# Altium project e3.PrjPcb
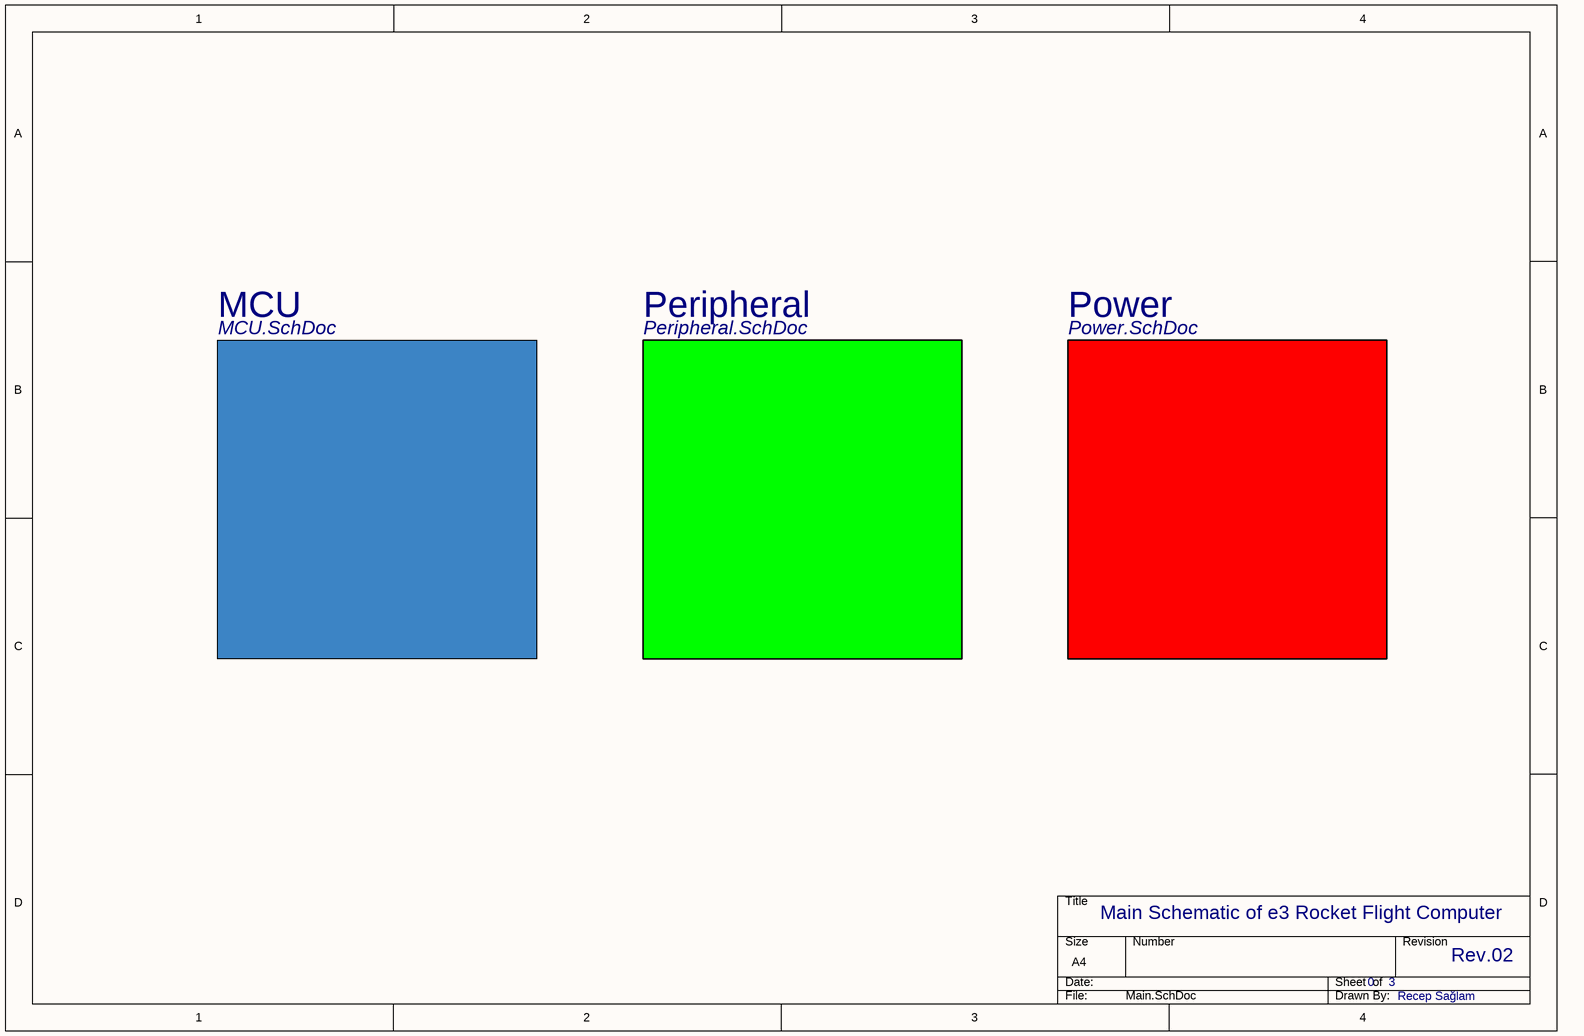
[diagram p0: Main.SchDoc]
4 sheets, 59 parts. Net scope: flat (ports and power ports of the same name join across sheets).
Board files: e3rev2.PcbDoc, e3rev1.PcbDoc
Sheets:
  Main.SchDoc
    MCU = MCU.SchDoc
    Power = Power.SchDoc
    Peripheral = Peripheral.SchDoc

## Sheet Main.SchDoc
size A4; SheetNumber: 1; SheetTotal: 4

### Sub-sheets
MCU = MCU.SchDoc: no entries
Peripheral = Peripheral.SchDoc: no entries
Power = Power.SchDoc: no entries

### Notes on the sheet
- Main Schematic of e3 Rocket Flight Computer
- 0
- 3
- Rev.02
- Recep Sağlam

## Sheet MCU.SchDoc
size 384 x 270 mm; SheetNumber: 2; SheetTotal: 4
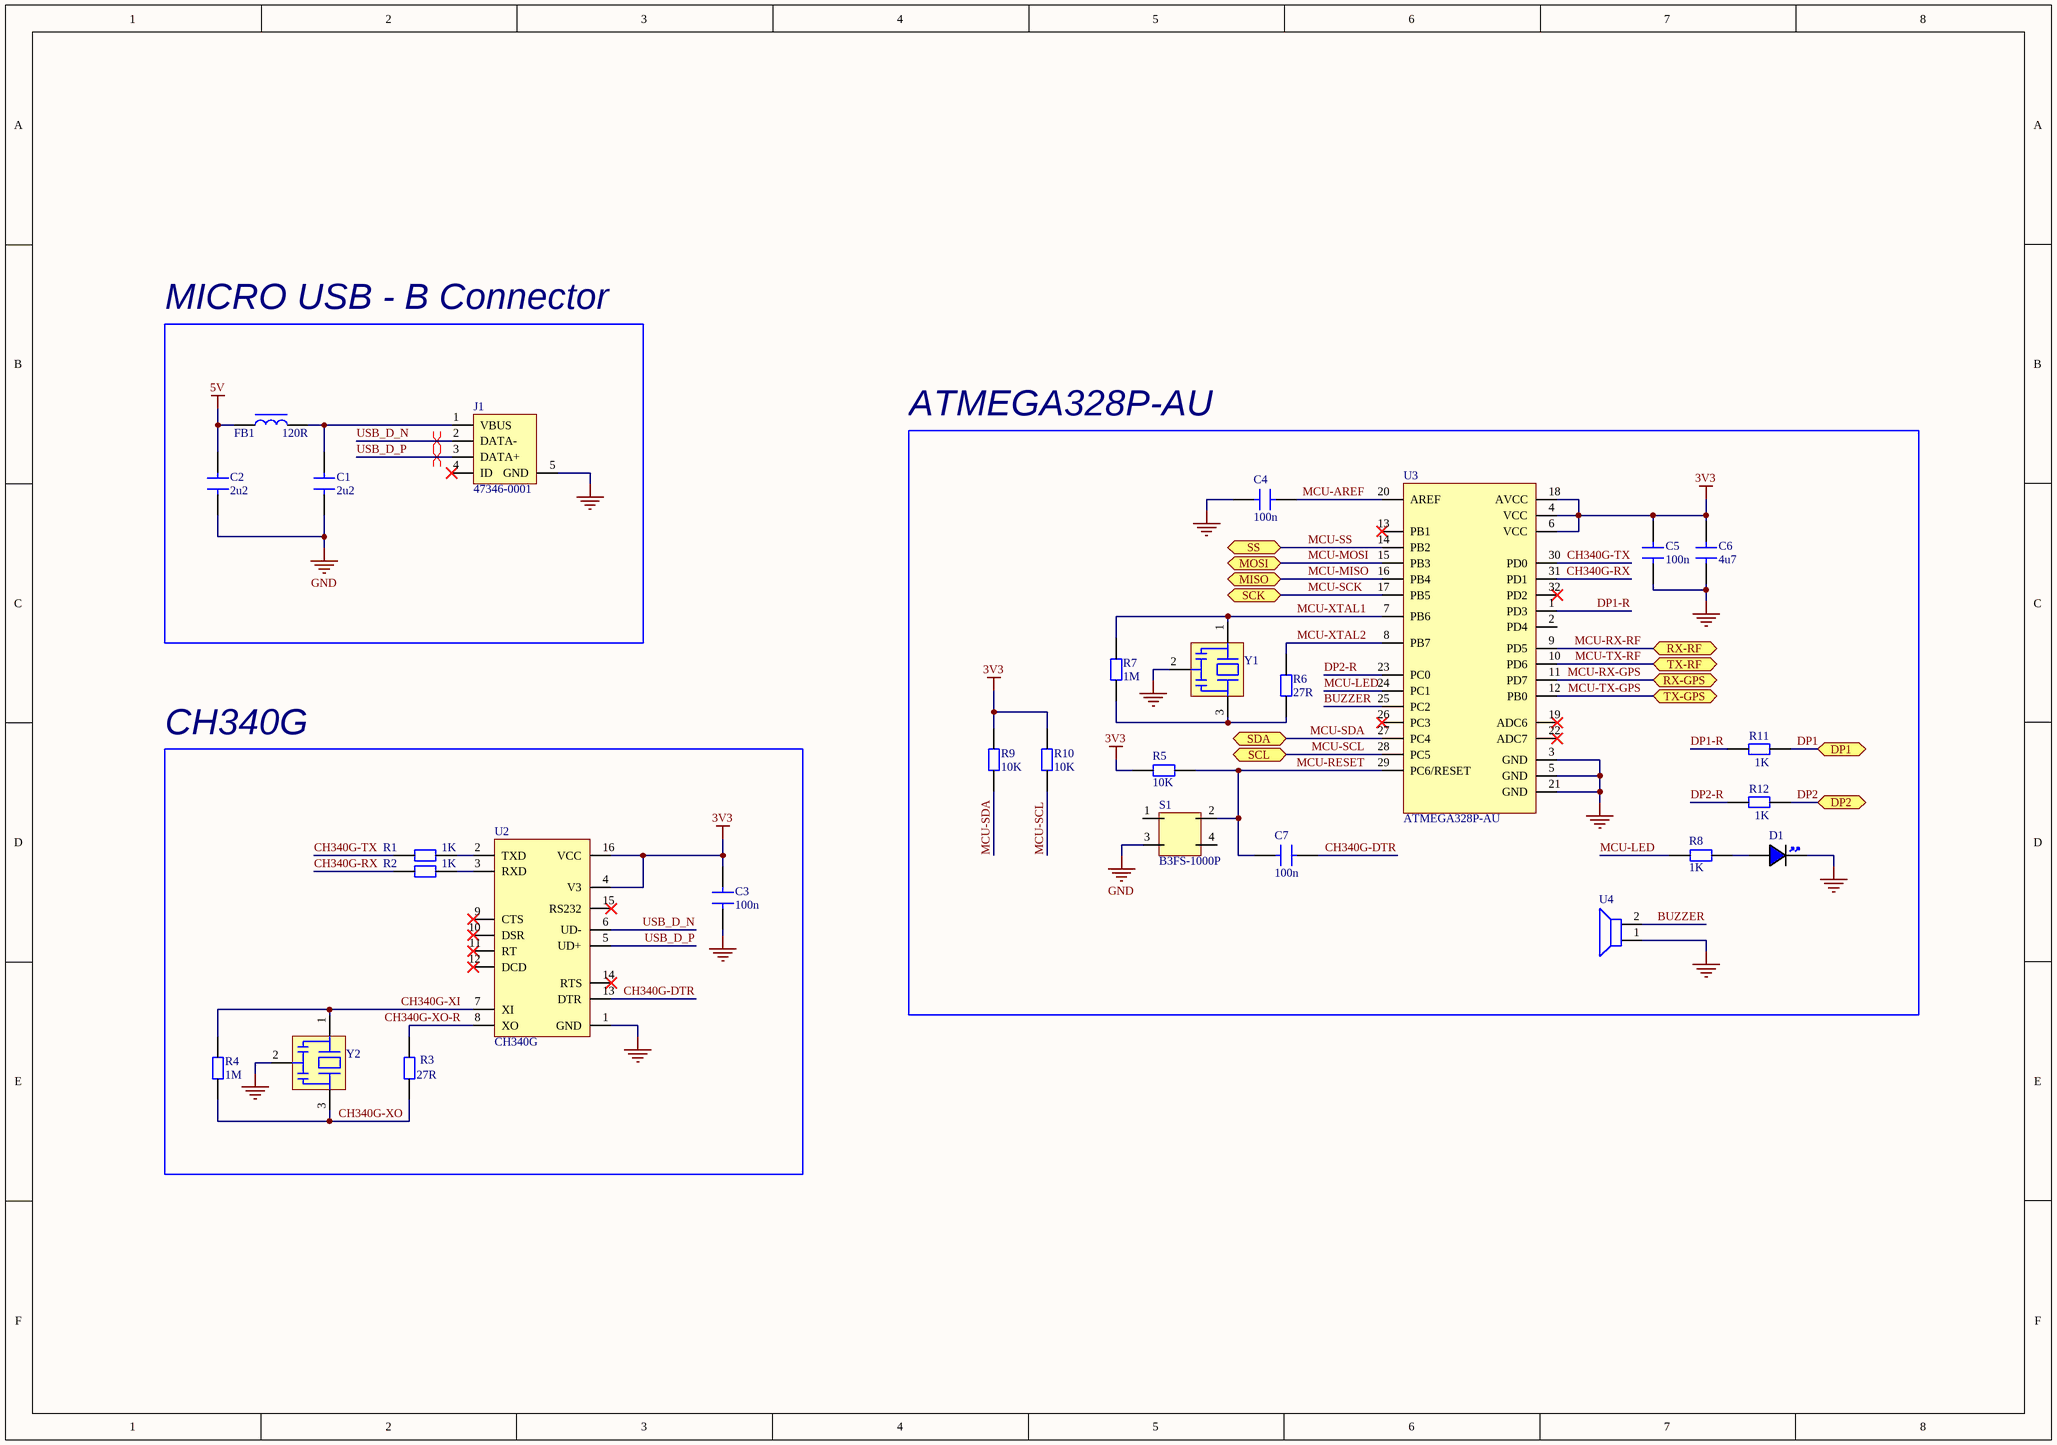
[diagram p1: MCU.SchDoc]

### Parts
C1  2u2  [CAP 0603]
C2  2u2  [CAP 0603]
C3  100n  [CAP 0603]
C4  100n  [CAP 0603]
C5  100n  [CAP 0603]
C6  4u7  [CAP 0603]
C7  100n  [CAP 0603]
D1  LED 0805 BLUE  [LED 0805 BLUE]  (value not drawn)
FB1  120R  [FB 0805]
J1  47346-0001  [MOLEX_47346-0001]
R1  1K  [RES 0603]
R2  1K  [RES 0603]
R3  27R  [RES 0603]
R4  1M  [RES 0603]
R5  10K  [RES 0603]
R6  27R  [RES 0603]
R7  1M  [RES 0603]
R8  1K  [RES 0603]
R9  10K  [RES 0603]
R10  10K  [RES 0603]
R11  1K  [RES 0603]
R12  1K  [RES 0603]
S1  B3FS-1000P  [B3FS-1000P]
U2  CH340G  [CH340G]
U3  ATMEGA328P-AU  [ATMEGA328P-AU]
U4  PS1240P02BT  [PS1240P02BT]  (value not drawn)
Y1  CSTNE16M0V53Z000R0  [CSTNE16M0V53Z000R0]  (value not drawn)
Y2  CSTNE12M0G550000R0  [CSTNE16M0V53Z000R0]  (value not drawn)

### Blocks framed on the sheet
MICRO USB - B Connector: C1 C2 FB1 J1
ATMEGA328P-AU: C4-C7 D1 R5-R12 S1 U3 U4 Y1
CH340G: C3 R1-R4 U2 Y2

### Ports
DP1 (bidir, see Power[1C]), DP2 (bidir, see Power[2C]), MISO (bidir, see Peripheral[1C], Peripheral[3D]), MOSI (bidir, see Peripheral[1C], Peripheral[3D]), RX-GPS (bidir, see Peripheral[4D]), RX-RF (bidir, see Peripheral[3D]), SCK (bidir, see Peripheral[1D], Peripheral[3D]), SCL (bidir, see Peripheral[2B], Peripheral[3A], Peripheral[3D]), SDA (bidir, see Peripheral[2A], Peripheral[3A], Peripheral[3D]), SS (bidir, see Peripheral[1C], Peripheral[3D]), TX-GPS (bidir, see Peripheral[4D]), TX-RF (bidir, see Peripheral[3D])

### Nets
3V3: C3.2 C5.2 C6.2 R5.1 R9.2 R10.2 U2.4(V3) U2.16(VCC) U3.4(VCC) U3.6(VCC) U3.18(AVCC)
5V: C2.1 FB1.1
GND: C1.2 C2.2 C3.1 C4.2 C5.1 C6.1 D1.K J1.5(GND) S1.3 U2.1(GND) U3.3(GND) U3.5(GND) U3.21(GND) U4.1 Y1.2 Y2.2
BUZZER: U3.25(PC2) U4.2
CH340G-DTR: C7.1 U2.13(DTR)
CH340G-RX: R2.2 U3.31(PD1)
CH340G-TX: R1.2 U3.30(PD0)
CH340G-XI: R4.2 U2.7(XI) Y2.1
CH340G-XO: R3.1 R4.1 Y2.3
CH340G-XO-R: R3.2 U2.8(XO)
DP1: R11.2 ; port DP1
DP1-R: R11.1 U3.1(PD3)
DP2: R12.2 ; port DP2
DP2-R: R12.1 U3.23(PC0)
MCU-AREF: C4.1 U3.20(AREF)
MCU-LED: R8.1 U3.24(PC1)
MCU-MISO: U3.16(PB4) ; port MISO
MCU-MOSI: U3.15(PB3) ; port MOSI
MCU-RESET: C7.2 R5.2 S1.2 U3.29(PC6/RESET)
MCU-RX-GPS: U3.11(PD7) ; port RX-GPS
MCU-RX-RF: U3.9(PD5) ; port RX-RF
MCU-SCK: U3.17(PB5) ; port SCK
MCU-SCL: R10.1 U3.28(PC5) ; port SCL
MCU-SDA: R9.1 U3.27(PC4) ; port SDA
MCU-SS: U3.14(PB2) ; port SS
MCU-TX-GPS: U3.12(PB0) ; port TX-GPS
MCU-TX-RF: U3.10(PD6) ; port TX-RF
MCU-XTAL1: R7.2 U3.7(PB6) Y1.1
MCU-XTAL2: R6.2 U3.8(PB7)
USB_D_N: J1.2(DATA-) U2.6(UD-)
USB_D_P: J1.3(DATA+) U2.5(UD+)
NetC1_1: C1.1 FB1.2 J1.1(VBUS)
NetD1_A: D1.A R8.2
NetR1_1: R1.1 U2.2(TXD)
NetR2_1: R2.1 U2.3(RXD)
NetR6_1: R6.1 R7.1 Y1.3

Not connected (* = marked no-connect by the designer): J1 4(ID)*; S1 1 4; U2 9(CTS)* 10(DSR)* 11(RT)* 12(DCD)* 14(RTS)* 15(RS232)*; U3 2(PD4) 13(PB1)* 19(ADC6)* 22(ADC7)* 26(PC3)* 32(PD2)*

### Layout directives
differential pair; differential pair class DIFF_USB: USB_D_N, USB_D_P

### Notes on the sheet
- DWG NO:
- REV:
- THIS DOCUMENT AND THE DATA DISCLOSED HEREIN OR
- HEREWITH IS THE PROPERTY OF ALTIUM LIMITED AND MAY
- BE FREELY DISTRIBUTED IN WHOLE. NO RIGHTS ARE
- RESERVED OR EXPRESS OR IMPLIED WARANTEE GIVEN.
- REVISION
- DESCRIPTION
- DATE
- APPROVED
- ENG:
- APPROVALS
- PROJECT
- DSN:
- CHK:
- REFERENCE DOCUMENTS
- PROJECT REVISION:
- TITLE
- DOCUMENT REVISION:
- DESIGN ITEM:
- BOM:
- FAB DWG:
- PCB DWG:
- ASSY DWG:
- SCALE:
- A2
- SIZE
- CAGE CODE
- FILE NAME
- DWG NO.
- SHEET
- OF
- REV

### Library data of the parts
C1-C7 = CAP 0603 50V: Capacitor SMD 0603 50V
D1 = LED 0805 BLUE: LED 0805 GREEN SMD
FB1 = FB 0805: Ferrite Bead SMD 0805
J1 = 47346-0001: Micro-USB B Receptacle with Flange, Bottom Mount, Surface Mount, Lead-Free; Manufacturer: Molex; Max Voltage Rating (AC): 30V; Number of Ports: 1; Contact Resistance: 40mR; Current Rating: 1.8A; Gender: Female; Connector Type: USB,Receptacle; Number of Contacts: 5; Contact Current Rating: 1A; USB Standard: USB 2.0; Pitch: 0.65mm; Glow Wire Compliant: Non-compliant; Supplier 1: Sager Electronics; Manufacturer Part Number: 47346-0001; RoHS: Yes; Category: Headers and Wire Housings; Stock 1: 14156; Pricing 1: 14000=0,5225 (USD); Mount: Surface Mount; Contact Plating: Gold; Contact Material: Copper Alloy,Copper; Housing Material: Polymer; Color: Black; Min Operating Temperature: -20°C; Max Operating Temperature: 85°C; Packaging: Tape and Reel; Termination: SMD/SMT; Orientation: Right Angle; Voltage Rating (AC): 30V; Voltage Rating: 30V; Number of Circuits: 5; Number of Positions: 5; Number of Rows: 1; Series: 47346; RoHS Compliant: Yes; Halogen Free: Low Halogen; Lead Free: Lead Free; Flammability Rating: UL94 V-0; Reach SVHC Compliant: Unknown; ComponentLink1URL: https://datasheet.ciiva.com/30075/304740473460001-io-nectors-30075527.pdf?src-supplier=Onlinecomponents.com; ComponentLink1Description: https://datasheet.ciiva.com/30075/304740473460001-io-nectors-30075527.pdf?src-supplier=Onlinecomponents.com; ComponentLink2URL: https://datasheet.ciiva.com/22654/1630785-22654942.pdf?src-supplier=Element14; ComponentLink2Description: https://datasheet.ciiva.com/22654/1630785-22654942.pdf?src-supplier=Element14; ComponentLink3URL: https://datasheet.ciiva.com/16148/1700180473460001-io-nectors-16148917.pdf?src-supplier=Onlinecomponents.com; ComponentLink3Description: https://datasheet.ciiva.com/16148/1700180473460001-io-nectors-16148917.pdf?src-supplier=Onlinecomponents.com; ComponentLink4URL: https://datasheet.ciiva.com/16986/70266948-16986683.pdf?src-supplier=Allied+Electronics; ComponentLink4Description: https://datasheet.ciiva.com/16986/70266948-16986683.pdf?src-supplier=Allied+Electronics; ComponentLink5URL: https://datasheet.ciiva.com/28504/0473460001-io-connectors-28504587.pdf?src-supplier=Element14; ComponentLink5Description: https://datasheet.ciiva.com/28504/0473460001-io-connectors-28504587.pdf?src-supplier=Element14; ComponentLink6URL: https://datasheet.ciiva.com/46390/1681853-46390956.pdf?src-supplier=Element14; ComponentLink6Description: https://datasheet.ciiva.com/46390/1681853-46390956.pdf?src-supplier=Element14
R1-R12 = RES 0603: Resistor SMD 0603
S1 = B3FS-1000P: Switch Tactile N.O. SPST Flat Round Button Gull Wing 0.05A 24VDC 0.98N SMD T/R; Manufacturer: Omron; Mechanical Life: 1000000Cycles; Actuator Color: Black; Current Rating: 50mA; Voltage Rating (DC): 24V; Contact Resistance: 100mR; Illumination Type: Non-Illuminated,Illuminated; Number of Poles: 1; Switch Travel: 0.25mm; Switch Function: Off-Mom; Actuator Type: Standard; Actuator Length: 0.5mm; Ratings: IP00; Supplier 1: Sager Electronics; Manufacturer Part Number: B3FS-1000P; RoHS: Yes; Category: Tactile Switches; Stock 1: 12000; Pricing 1: 3000=0,316, 12000=0,305 (USD); Mount: Surface Mount; Case/Package: SMD/SMT; Contact Plating: Silver; Weight: 0.2g; Contact Material: Silver; Material: Plastic; Min Operating Temperature: -20°C; Max Operating Temperature: 70°C; Package Quantity: 3000; Operating Force: 0.98N; Packaging: Tape and Reel; Contact Current Rating: 50mA; Throw Configuration: SPST; Max Current Rating: 50mA; Max Voltage Rating (DC): 24V; Termination: Gull Wing; Electrical Life: 1000000Cycles; Orientation: Straight; Series: B3FS; Length: 6.3mm; Depth: 8mm; Lead Free: Lead Free; RoHS Compliant: Yes; Reach SVHC Compliant: Unknown; ComponentLink1URL: https://datasheet.ciiva.com/1532/en-b3fs-1532627.pdf?src-supplier=Element14; ComponentLink1Description: https://datasheet.ciiva.com/1532/en-b3fs-1532627.pdf?src-supplier=Element14; ComponentLink2URL: https://datasheet.ciiva.com/16154/en-b3fs-16154936.pdf?src-supplier=Onlinecomponents.com; ComponentLink2Description: https://datasheet.ciiva.com/16154/en-b3fs-16154936.pdf?src-supplier=Onlinecomponents.com; ComponentLink3URL: https://datasheet.ciiva.com/26827/getdatasheetpartid-131603-26827237.pdf?src-supplier=Verical; ComponentLink3Description: https://datasheet.ciiva.com/26827/getdatasheetpartid-131603-26827237.pdf?src-supplier=Verical; ComponentLink4URL: https://datasheet.ciiva.com/30214/b3fs-0714-30214221.pdf?src-supplier=Onlinecomponents.com; ComponentLink4Description: https://datasheet.ciiva.com/30214/b3fs-0714-30214221.pdf?src-supplier=Onlinecomponents.com; ComponentLink5URL: https://datasheet.ciiva.com/2899/en-b3fs-2899745.pdf?src-supplier=Digi-Key; ComponentLink5Description: https://datasheet.ciiva.com/2899/en-b3fs-2899745.pdf?src-supplier=Digi-Key; ComponentLink6URL: https://datasheet.ciiva.com/2899/en-b3fs-2899746.pdf?src-supplier=Digi-Key; ComponentLink6Description: https://datasheet.ciiva.com/2899/en-b3fs-2899746.pdf?src-supplier=Digi-Key; ComponentLink7URL: https://datasheet.ciiva.com/2899/en-b3fs-2899744.pdf?src-supplier=Digi-Key; ComponentLink7Description: https://datasheet.ciiva.com/2899/en-b3fs-2899744.pdf?src-supplier=Digi-Key
U2 = CH340G: USB Interface Integrated Circuit
U3 = ATMEGA328P-AU: 8-bit AVR MCU, 32 KB, 2048 Bytes, 20 MHz, 1.8 to 5.5V, TQFP-32, RoHS; Manufacturer: Microchip; Interface: I2C,SPI,USART; Number of I/Os: 23; Oscillator Type: Internal; Memory Type: FLASH; Memory Size: 32KB; Peripherals: Brown-out Detect/Reset,POR,PWM,WDT; Frequency: 20MHz; RAM Size: 2KB; Min Supply Voltage: 1.8V; Number of Timers/Counters: 3; Number of ADC Channels: 8; Number of PWM Channels: 6; Data Bus Width: 8b; Number of SPI Channels: 1; Watchdog Timer: Yes; Supplier 1: Farnell; Manufacturer Part Number: ATMEGA328P-AU; RoHS: Yes; Stock 1: 196910; Pricing 1: 1=3,05, 25=2,48, 100=2,42, 250=2,37 (EUR); Mount: Surface Mount; Case/Package: A; Number of Pins: 32; Weight: 0.002469oz; Min Operating Temperature: -40°C; Max Operating Temperature: 85°C; Packaging: Tray; Core Architecture: AVR; Series: ATmega328P; Package Quantity: 250; Max Supply Voltage: 5.5V; Number of Programmable I/O: 23; Max Frequency: 20MHz; Number of I2C Channels: 1; Length: 7mm; Width: 7mm; Height: 1mm; Radiation Hardening: No; RoHS Compliant: Yes; Reach SVHC Compliant: Yes; Lead Free: Lead Free; ComponentLink1URL: https://datasheet.ciiva.com/1166/doc8161-1166860.pdf?src-supplier=Newark; ComponentLink1Description: https://datasheet.ciiva.com/1166/doc8161-1166860.pdf?src-supplier=Newark; ComponentLink2URL: https://datasheet.ciiva.com/29119/155196-da-01-en-microcontr-atmega328p-au-8bit-tqfp-32-29119594.pdf?src-supplier=Conrad; ComponentLink2Description: https://datasheet.ciiva.com/29119/155196-da-01-en-microcontr-atmega328p-au-8bit-tqfp-32-29119594.pdf?src-supplier=Conrad; ComponentLink3URL: https://datasheet.ciiva.com/1157/1693866-1157693.pdf?src-supplier=Element14; ComponentLink3Description: https://datasheet.ciiva.com/1157/1693866-1157693.pdf?src-supplier=Element14; ComponentLink4URL: https://datasheet.ciiva.com/15213/getdatasheetpartid-365828-15213131.pdf?src-supplier=Verical; ComponentLink4Description: https://datasheet.ciiva.com/15213/getdatasheetpartid-365828-15213131.pdf?src-supplier=Verical
U4 = PS1240P02BT: Audio Buzzer Piezo 30Vo-p 3Vo-p 70dBA Through Hole Pin Ammo; Manufacturer: TDK; Supplier 1: CoreStaff; Manufacturer Part Number: PS1240P02BT; RoHS: Yes; Category: Audio Products; Stock 1: 34; Pricing 1: 1=156, 10=90, 50=60, 100=45, 500=39, 1000=34,5, 2000=30, 4000=29,1 (JPY); ComponentLink1URL: https://datasheet.ciiva.com/0/ef532-ps-112.pdf?src-supplier=Digi-Key; ComponentLink1Description: https://datasheet.ciiva.com/0/ef532-ps-112.pdf?src-supplier=Digi-Key; ComponentLink2URL: https://datasheet.ciiva.com/0/ef532-ps-111.pdf?src-supplier=Digi-Key; ComponentLink2Description: https://datasheet.ciiva.com/0/ef532-ps-111.pdf?src-supplier=Digi-Key; ComponentLink3URL: https://datasheet.ciiva.com/3306/ef532-ps-3306958.pdf?src-supplier=Avnet; ComponentLink3Description: https://datasheet.ciiva.com/3306/ef532-ps-3306958.pdf?src-supplier=Avnet; ComponentLink4URL: https://datasheet.ciiva.com/16225/ef532-ps-16225062.pdf?src-supplier=Onlinecomponents.com; ComponentLink4Description: https://datasheet.ciiva.com/16225/ef532-ps-16225062.pdf?src-supplier=Onlinecomponents.com
Y1 = CSTNE16M0V53Z000R0: Ceramic Resonator 16MHz ±0.5% (Tol) ±0.3% (Stability) 15pF 40Ohm 3-Pin CSMD T/R; Manufacturer: Murata; Impedance: 40R; Supplier 1: Arrow Electronics; Manufacturer Part Number: CSTNE16M0V53Z000R0; RoHS: Yes; Category: Resonators; Stock 1: 87000; Pricing 1: 3000=0,1298, 6000=0,1244, 15000=0,1189 (USD); Mount: Surface Mount; Case/Package: SMD/SMT; Min Operating Temperature: -40°C; Max Operating Temperature: 125°C; Packaging: Cut Tape; Frequency: 16MHz; Frequency Stability: 0.3%; Frequency Tolerance: 0.5%; Capacitance: 15pF; Series: CERALOCK® CSTNE; RoHS Compliant: Yes; ComponentLink1URL: https://www.murata.com/en/products/productdata/8801162199070/SPEC-CSTNE16M0V53Z000R0.pdf?src-supplier=Digi-Key; ComponentLink1Description: https://www.murata.com/en/products/productdata/8801162199070/SPEC-CSTNE16M0V53Z000R0.pdf?src-supplier=Digi-Key
Y2 = CSTNE12M0G550000R0: Ceramic Resonator 12MHz ±0.5% (Tol ) ±0.2% (Stability) 33PF 30Ohm 3-Pin CSMD; Manufacturer: Murata; Supplier 1: CoreStaff; Manufacturer Part Number: CSTNE12M0G550000R0; RoHS: Yes; Category: Resonators; Stock 1: 10; Pricing 1: 1=77,6, 10=58,2, 50=36,86, 100=27,16, 500=17,46, 1000=15,52, 2000=14,55, 4000=14,36 (JPY); ComponentLink1URL: https://www.murata.com/en/products/productdata/8801162067998/SPEC-CSTNE12M0G550000R0.pdf?src-supplier=Digi-Key; ComponentLink1Description: https://www.murata.com/en/products/productdata/8801162067998/SPEC-CSTNE12M0G550000R0.pdf?src-supplier=Digi-Key; ComponentLink2URL: https://datasheet.octopart.com/CSTNE12M0G550000R0-Murata-datasheet-137044759.pdf?src-supplier=Future+Electronics; ComponentLink2Description: https://datasheet.octopart.com/CSTNE12M0G550000R0-Murata-datasheet-137044759.pdf?src-supplier=Future+Electronics; ComponentLink3URL: https://datasheet.octopart.com/CSTNE12M0G550000R0-Murata-datasheet-165611788.pdf?src-supplier=TME; ComponentLink3Description: https://datasheet.octopart.com/CSTNE12M0G550000R0-Murata-datasheet-165611788.pdf?src-supplier=TME

## Sheet Power.SchDoc
size A4; SheetNumber: 4; SheetTotal: 4
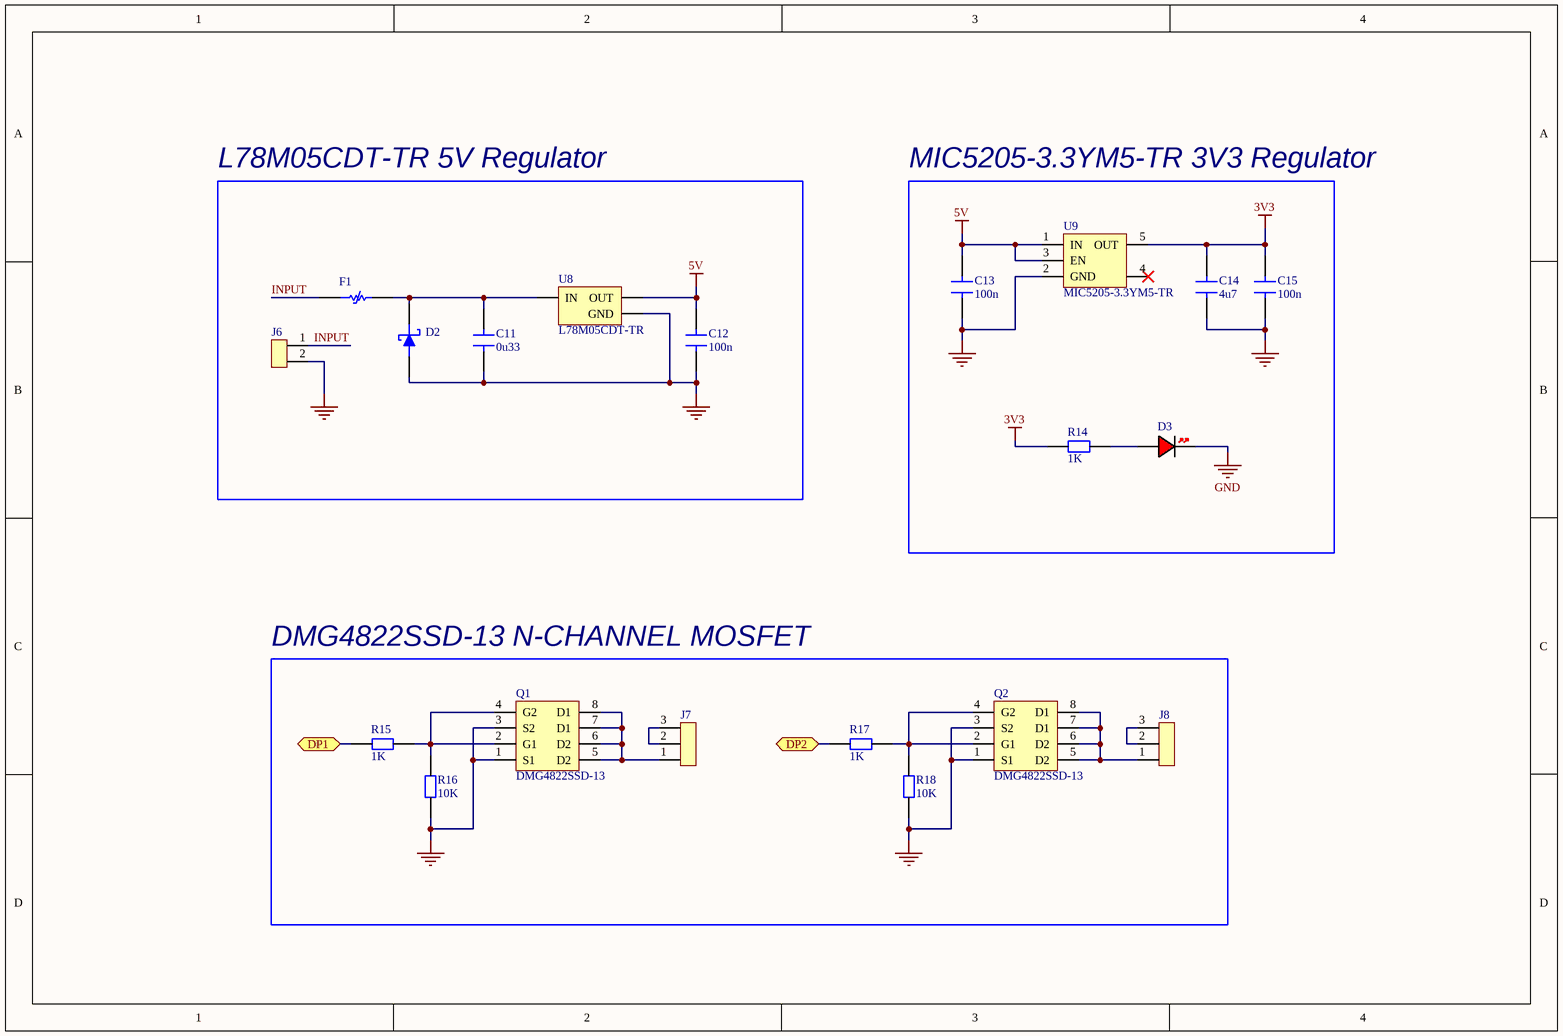
[diagram p2: Power.SchDoc]

### Parts
C11  0u33  [CAP 0805]
C12  100n  [CAP 0805]
C13  100n  [CAP 0805]
C14  4u7  [CAP 0805]
C15  100n  [CAP 0805]
D2  SMBJ12CA-13-F  [SMBJ12CA-13-F]  (value not drawn)
D3  LED 0805 RED  [LED 0805 RED]  (value not drawn)
F1  0ZCG0075FF2C  [0ZCG0075FF2C]  (value not drawn)
J6  KF301 2P Terminal  [KF301 2P]  (value not drawn)
J7  KF301 3P Terminal  [KF301 3P]  (value not drawn)
J8  KF301 3P Terminal  [KF301 3P]  (value not drawn)
Q1  DMG4822SSD-13  [DMG4822SSD-13]
Q2  DMG4822SSD-13  [DMG4822SSD-13]
R14  1K  [RES 0603]
R15  1K  [RES 0603]
R16  10K  [RES 0603]
R17  1K  [RES 0603]
R18  10K  [RES 0603]
U8  L78M05CDT-TR  [L78M05CDT-TR]
U9  MIC5205-3.3YM5-TR  [MIC5205-3.3YM5-TR]

### Blocks framed on the sheet
L78M05CDT-TR 5V Regulator: C11 C12 D2 F1 J6 U8
MIC5205-3.3YM5-TR 3V3 Regulator: C13-C15 D3 R14 U9
DMG4822SSD-13 N-CHANNEL MOSFET: J7 J8 Q1 Q2 R15-R18

### Ports
DP1 (bidir, see MCU[7C]), DP2 (bidir, see MCU[7C])

### Nets
3V3: C14.2 C15.2 R14.1 U9.5(OUT)
5V: C12.2 C13.2 U8.3(OUT) U9.1(IN) U9.3(EN)
GND: C11.1 C12.1 C13.1 C14.1 C15.1 D2.1 D3.K J6.2 Q1.1(S1) Q1.3(S2) Q2.1(S1) Q2.3(S2) R16.1 R18.1 U8.2(GND) U9.2(GND)
DP1: R15.1 ; port DP1
DP2: R17.1 ; port DP2
INPUT: F1.1 J6.1
NetC11_2: C11.2 D2.2 F1.2 U8.1(IN)
NetD3_A: D3.A R14.2
NetJ7_1: J7.1 Q1.5(D2) Q1.6(D2) Q1.7(D1) Q1.8(D1)
NetJ7_2: J7.2 J7.3
NetJ8_1: J8.1 Q2.5(D2) Q2.6(D2) Q2.7(D1) Q2.8(D1)
NetJ8_2: J8.2 J8.3
NetQ1_2: Q1.2(G1) Q1.4(G2) R15.2 R16.2
NetQ2_2: Q2.2(G1) Q2.4(G2) R17.2 R18.2

Not connected (* = marked no-connect by the designer): U9 4*

### Library data of the parts
C11-C15 = CAP 0805 50V: Capacitor SMD 0805 50V
D2 = SMBJ12CA-13-F: TVS DIODE 12VWM 19.9VC SMB; Manufacturer: Diodes; Package Body Material: Plastic; Diode Element Material: SILICON; Voltage Rating (DC): 12V; Direction: Bidirectional; Reverse Breakdown Voltage: 13.3V; Number of Elements: 1; Max Power Dissipation: 600W; Max Surge Current: 30.2A; Breakdown Voltage: 15.3V; Clamping Voltage: 19.9V; Max Reverse Leakage Current: 5uA; Test Current: 1mA; Capacitance: 340pF; Diode Type: ZENER; Time @ Peak Reflow Temperature-Max (s): 5s; Power Line Protection: No; Supplier 1: Future Electronics; Manufacturer Part Number: SMBJ12CA-13-F; RoHS: Yes; Category: TVS Diodes; Stock 1: 27000; Pricing 1: 3000=0,104, 9000=0,0995, 12000=0,0985, 30000=0,0953, 45000=0,0922 (USD); Mount: Surface Mount; Case/Package: SMB; Number of Pins: 2; Terminal Finish: Tin; Package Shape: Rectangular; Min Operating Temperature: -55°C; Max Operating Temperature: 150°C; Package Quantity: 3000; Packaging: Tape and Reel; Series: SMBJ; Reverse Standoff Voltage: 12V; Polarity: Bidirectional; Peak Pulse Power: 600W; Termination: SMD/SMT; Min Breakdown Voltage: 13.3V; Peak Pulse Current: 30.2A; Max Breakdown Voltage: 15.3V; Power Dissipation: 600W; Leakage Current: 5uA; Working Voltage: 12V; Max Output Current: 30.2A; Moisture Sensitivity Level: 1; JESD-30 Code: R-PDSO-C2; Surface Mount: Yes; Terminal Position: DUAL; Technology: AVALANCHE; Peak Reflow Temperature (Cel): 245°C; Terminal Form: C BEND; Clamping Voltage-Max: 19.9V; Number of Bidirectional Channels: 1; Length: 4.57mm; Width: 3.9mm; Height: 2.62mm; Radiation Hardening: No; Lead Free: Contains Lead; RoHS Compliant: Yes; ComponentLink1URL: https://datasheet.ciiva.com/34302/1542303-34302437.pdf?src-supplier=Jameco; ComponentLink1Description: https://datasheet.ciiva.com/34302/1542303-34302437.pdf?src-supplier=Jameco
D3 = LED 0805 RED: LED 0805 RED SMD
F1 = 0ZCG0075FF2C: PTC Resettable Fuse 0.75A(hold) 1.5A(trip) 16VDC 100A 0.8W 0.2s 0.11Ohm SMD Solder Pad 1812 4.73 X 3.41 X 0.65mm T/R...; Manufacturer: Bel; Hold Current: 750mA; Time to Trip: 200ms; Supplier 1: Arrow Electronics; Manufacturer Part Number: 0ZCG0075FF2C; RoHS: Yes; Category: PTC Resettable Fuses; Stock 1: 4661; Pricing 1: 2000=0,0751, 4000=0,0699, 6000=0,065, 10000=0,0604 (USD); Mount: Surface Mount; Case/Package: 1812; Case Code (Metric): 4532; Case Code (Imperial): 1812; Contact Plating: Tin,Matte; Min Operating Temperature: -40°C; Max Operating Temperature: 85°C; Packaging: Cut Tape; Max Current Rating: 100A; Trip Current: 1.5A; Series: 0ZCG; Lead Free: Lead Free; RoHS Compliant: Yes; ComponentLink1URL: https://datasheet.ciiva.com/18550/0zcg-18550523.pdf?src-supplier=Digi-Key; ComponentLink1Description: https://datasheet.ciiva.com/18550/0zcg-18550523.pdf?src-supplier=Digi-Key; ComponentLink2URL: https://datasheet.ciiva.com/18550/0zcg-18550524.pdf?src-supplier=Digi-Key; ComponentLink2Description: https://datasheet.ciiva.com/18550/0zcg-18550524.pdf?src-supplier=Digi-Key; ComponentLink3URL: https://datasheet.ciiva.com/18550/0zcg-18550767.pdf?src-supplier=Digi-Key; ComponentLink3Description: https://datasheet.ciiva.com/18550/0zcg-18550767.pdf?src-supplier=Digi-Key
J6 = KF301 2P Terminal: 2 Pin Screw Terminal Block 5mm
J7 J8 = KF301 3P Terminal: 3 Pin Screw Terminal Block 5mm
Q1 Q2 = DMG4822SSD-13: Dual N-Channel 30 V 1.42 W 10.5 nC Enhancement Mode Mosfet - SOIC-8; Manufacturer: Diodes; Rds On Max: 20mR; Input Capacitance: 478.9pF; Rise Time: 7.9ns; Drain to Source Voltage (Vdss): 30V; Continuous Drain Current (ID): 10A; Max Power Dissipation: 1.42W; Fall Time: 3.1ns; Turn-Off Delay Time: 14.6ns; Turn-On Delay Time: 2.9ns; Gate to Source Voltage (Vgs): 25V; Number of Channels: 2; FET Type: 2 N-Channel; Supplier 1: Arrow Electronics; Manufacturer Part Number: DMG4822SSD-13; RoHS: Yes; Category: MOSFETs; Stock 1: 2374; Pricing 1: 1=0,5556, 10=0,4998, 25=0,4948, 100=0,3987, 250=0,3947, 500=0,3232, 1000=0,265 (USD); Mount: Surface Mount; Case/Package: SOIC; Number of Pins: 8; Weight: 0.00261oz; Min Operating Temperature: -55°C; Max Operating Temperature: 150°C; Package Quantity: 2500; Packaging: Tape and Reel; Drain to Source Resistance: 20mR; Polarity: N-CHANNEL; Series: -; Length: 4.95mm; Width: 3.95mm; Height: 1.5mm; Radiation Hardening: No; Lead Free: Lead Free; Reach SVHC Compliant: Yes; RoHS Compliant: Yes; ComponentLink1URL: https://datasheet.ciiva.com/4443/dmg4822ssd-10758-4443079.pdf?src-supplier=Mouser; ComponentLink1Description: https://datasheet.ciiva.com/4443/dmg4822ssd-10758-4443079.pdf?src-supplier=Mouser; ComponentLink2URL: https://datasheet.ciiva.com/6386/dmg4822ssd-6386688.pdf?src-supplier=Digi-Key; ComponentLink2Description: https://datasheet.ciiva.com/6386/dmg4822ssd-6386688.pdf?src-supplier=Digi-Key; ComponentLink3URL: https://datasheet.ciiva.com/11174/dmg4822ssd-11174891.pdf?src-supplier=Avnet; ComponentLink3Description: https://datasheet.ciiva.com/11174/dmg4822ssd-11174891.pdf?src-supplier=Avnet
R14-R18 = RES 0603: Resistor SMD 0603
U8 = L78M05CDT-TR: IC REG LDO 5V 0.5A DPAK; Manufacturer: STMicroelectronics; Number of Outputs: 1; Max Input Voltage: 35V; Max Output Current: 500mA; Polarity: Positive; Quiescent Current: 6mA; Output Type: Fixed; Min Input Voltage: 7V; Dropout Voltage: 2V; Tolerance: 5%; Power Supply Rejection Ratio (PSRR): 62dB; Supplier 1: Mouser; Manufacturer Part Number: L78M05CDT-TR; RoHS: Yes; Category: Voltage Regulators - Linear; Stock 1: 74380; Pricing 1: 1=0,72, 10=0,629, 50=0,629, 100=0,482, 1000=0,305, 10000=0,277 (USD); Mount: Surface Mount; Case/Package: TO-252; Number of Pins: 3; Min Operating Temperature: 0°C; Max Operating Temperature: 150°C; Output Voltage: 5V; Packaging: Tape and Reel; Package Quantity: 2500; Output Current: 500mA; Nominal Output Voltage: 5V; Number of Regulators: 1; Min Output Voltage: 5V; Max Output Voltage: 5V; Series: -; Output Configuration: Positive; Length: 6.6mm; Width: 6.2mm; Height: 2.4mm; Radiation Hardening: No; RoHS Compliant: Yes; Reach SVHC Compliant: No; Lead Free: Lead Free; ComponentLink1URL: https://datasheet.ciiva.com/34303/2021024-34303902.pdf?src-supplier=Jameco; ComponentLink1Description: https://datasheet.ciiva.com/34303/2021024-34303902.pdf?src-supplier=Jameco; ComponentLink2URL: https://datasheet.ciiva.com/4882/cd00000447-93067-4882369.pdf?src-supplier=Mouser; ComponentLink2Description: https://datasheet.ciiva.com/4882/cd00000447-93067-4882369.pdf?src-supplier=Mouser; ComponentLink3URL: https://datasheet.ciiva.com/15111/getdatasheetpartid-111001-15111751.pdf?src-supplier=Verical; ComponentLink3Description: https://datasheet.ciiva.com/15111/getdatasheetpartid-111001-15111751.pdf?src-supplier=Verical; ComponentLink4URL: https://datasheet.ciiva.com/1512/1834365-1512349.pdf?src-supplier=Element14; ComponentLink4Description: https://datasheet.ciiva.com/1512/1834365-1512349.pdf?src-supplier=Element14; ComponentLink5URL: https://datasheet.ciiva.com/14111/tbl78mxxc-data-e-14111354.pdf?src-supplier=Distrelec; ComponentLink5Description: https://datasheet.ciiva.com/14111/tbl78mxxc-data-e-14111354.pdf?src-supplier=Distrelec; ComponentLink6URL: https://datasheet.ciiva.com/46425/1834365-46425535.pdf?src-supplier=Element14; ComponentLink6Description: https://datasheet.ciiva.com/46425/1834365-46425535.pdf?src-supplier=Element14; ComponentLink7URL: https://datasheet.ciiva.com/2041/cd00000447-2041991.pdf?src-supplier=Digi-Key; ComponentLink7Description: https://datasheet.ciiva.com/2041/cd00000447-2041991.pdf?src-supplier=Digi-Key; ComponentLink8URL: https://datasheet.ciiva.com/2041/cd00000447-2041990.pdf?src-supplier=Digi-Key; ComponentLink8Description: https://datasheet.ciiva.com/2041/cd00000447-2041990.pdf?src-supplier=Digi-Key; ComponentLink9URL: https://datasheet.ciiva.com/2041/cd00000447-2041992.pdf?src-supplier=Digi-Key; ComponentLink9Description: https://datasheet.ciiva.com/2041/cd00000447-2041992.pdf?src-supplier=Digi-Key; ComponentLink10URL: https://datasheet.ciiva.com/16443/cd00000447-16443381.pdf?src-supplier=Future+Electronics; ComponentLink10Description: https://datasheet.ciiva.com/16443/cd00000447-16443381.pdf?src-supplier=Future+Electronics; ComponentLink11URL: https://datasheet.ciiva.com/41439/001184659-da-01-en-ic-reg-ldo-5v-l78m05cdt-tr-to-252-3-stm-41439772.pdf?src-supplier=Conrad; ComponentLink11Description: https://datasheet.ciiva.com/41439/001184659-da-01-en-ic-reg-ldo-5v-l78m05cdt-tr-to-252-3-stm-41439772.pdf?src-supplier=Conrad
U9 = MIC5205-3.3YM5-TR: Linear Voltage Regulator IC Positive Fixed 1 Output 3.3V 150mA SOT-23-5; Manufacturer: Microchip; Dropout Voltage: 165mV; Number of Regulators: 1; Min Input Voltage: 2.5V; Max Input Voltage: 16V; Power Supply Rejection Ratio (PSRR): 75dB; Accuracy: 1%; Supplier 1: Arrow Electronics; Manufacturer Part Number: MIC5205-3.3YM5-TR; RoHS: Yes; Category: Voltage Regulators - Linear; Stock 1: 2538; Pricing 1: 1=0,5386, 10=0,5334, 25=0,4417, 50=0,4373, 100=0,395, 250=0,3909, 500=0,3869, 1000=0,3827, 3000=0,3677 (USD); Mount: Surface Mount; Case/Package: SOT-23; Number of Pins: 5; Min Operating Temperature: -40°C; Max Operating Temperature: 125°C; Packaging: Tape and Reel; Output Voltage: 3.3V; Output Current: 150mA; Nominal Output Voltage: 3.3V; Number of Outputs: 1; Output Type: Fixed; Polarity: Positive; Series: -; Max Output Current: 150mA; Output Voltage Accuracy: 1%; Max Output Voltage: 3.3V; Max Supply Voltage: 16V; Min Supply Voltage: 2.5V; Termination: SMD/SMT; Length: 2.9mm; Width: 1.6mm; Height: 1.1mm; Radiation Hardening: No; Reach SVHC Compliant: No; Lead Free: Lead Free; RoHS Compliant: Yes

## Sheet Peripheral.SchDoc
size A4; SheetNumber: 3; SheetTotal: 4
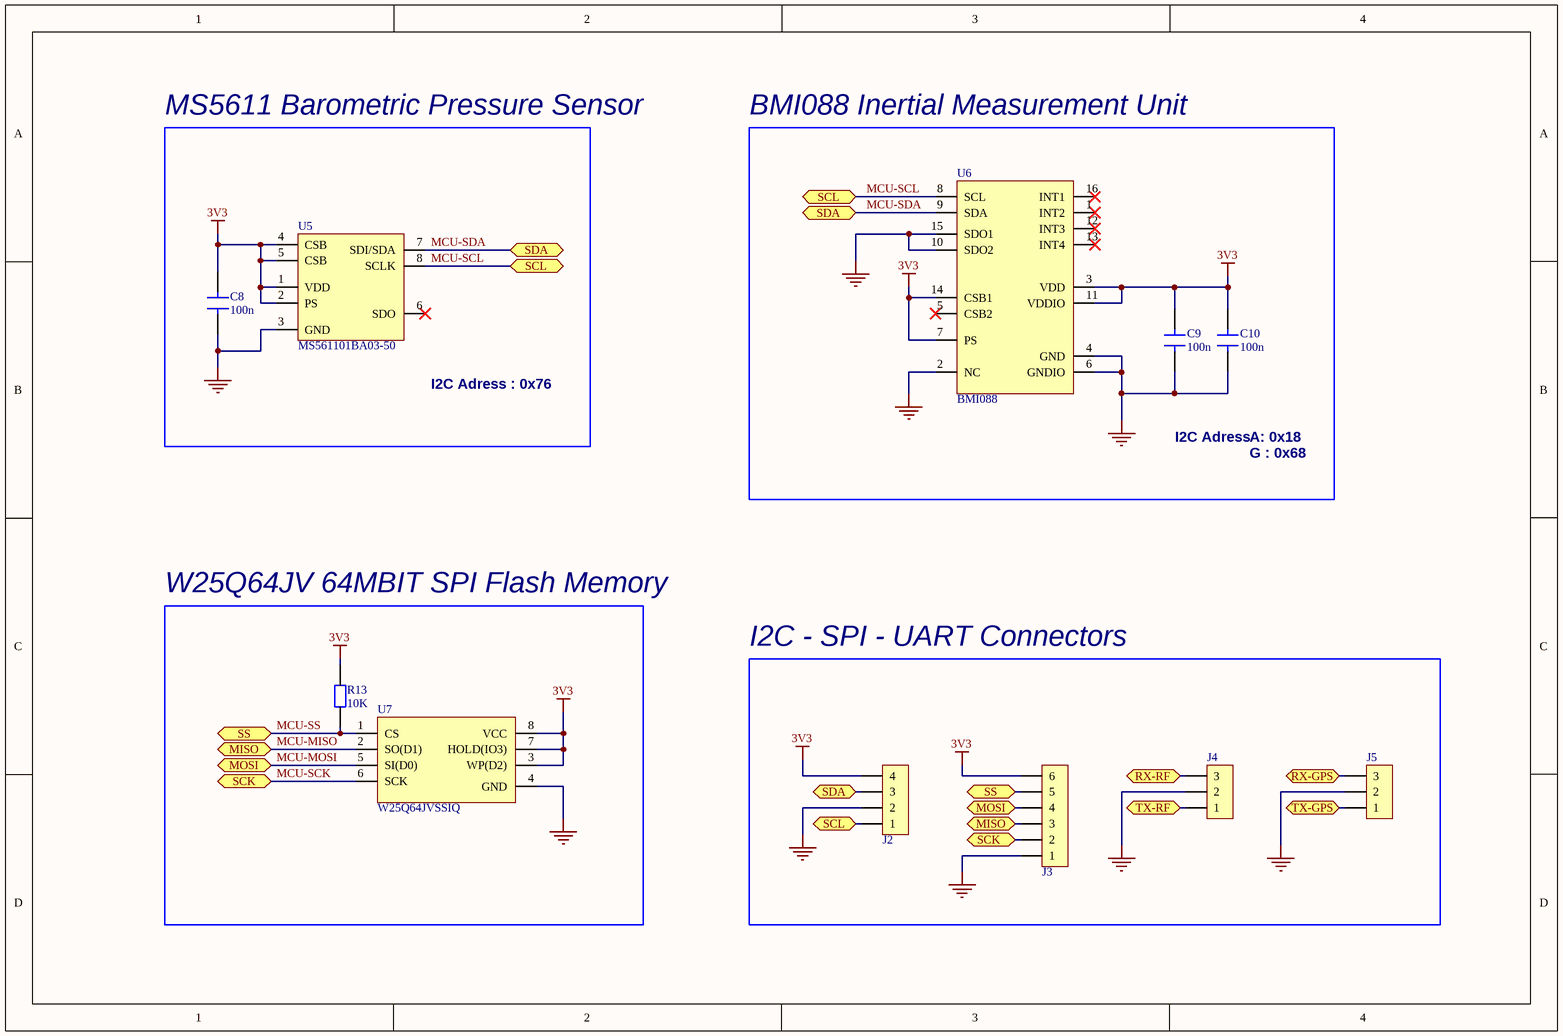
[diagram p3: Peripheral.SchDoc]

### Parts
C8  100n  [CAP 0603]
C9  100n  [CAP 0603]
C10  100n  [CAP 0603]
J2  1x4 HEADER MALE  [1X4 HEADER MALE]  (value not drawn)
J3  1x6 HEADER MALE  [1X6 HEADER MALE]  (value not drawn)
J4  JST B3B-XH-A  [JST_B3B-XH-A]  (value not drawn)
J5  JST B3B-XH-A  [JST_B3B-XH-A]  (value not drawn)
R13  10K  [RES 0603]
U5  MS561101BA03-50  [MS5611-01BA3]
U6  BMI088  [BMI088]
U7  W25Q64JVSSIQ  [W25Q64JVSSIQ]

### Blocks framed on the sheet
MS5611 Barometric Pressure Sensor: C8 U5
BMI088 Inertial Measurement Unit: C9 C10 U6
W25Q64JV 64MBIT SPI Flash Memory: R13 U7
I2C - SPI - UART Connectors: J2-J5

### Ports
MISO (bidir, see MCU[5C], Peripheral[1C]), MISO (bidir, see MCU[5C], Peripheral[3D]), MOSI (bidir, see MCU[5C], Peripheral[1C]), MOSI (bidir, see MCU[5C], Peripheral[3D]), RX-GPS (bidir, see MCU[7C]), RX-RF (bidir, see MCU[7C]), SCK (bidir, see MCU[5C], Peripheral[1D]), SCK (bidir, see MCU[5C], Peripheral[3D]), SCL (bidir, see MCU[5D], Peripheral[2B], Peripheral[3A]), SCL (bidir, see MCU[5D], Peripheral[2B], Peripheral[3D]), SCL (bidir, see MCU[5D], Peripheral[3A], Peripheral[3D]), SDA (bidir, see MCU[5D], Peripheral[2A], Peripheral[3A]), SDA (bidir, see MCU[5D], Peripheral[2A], Peripheral[3D]), SDA (bidir, see MCU[5D], Peripheral[3A], Peripheral[3D]), SS (bidir, see MCU[5C], Peripheral[1C]), SS (bidir, see MCU[5C], Peripheral[3D]), TX-GPS (bidir, see MCU[7C]), TX-RF (bidir, see MCU[7C])

### Nets
3V3: C8.2 C9.2 C10.2 J2.4 J3.6 R13.2 U5.1(VDD) U5.2(PS) U5.4(CSB) U5.5(CSB) U6.3(VDD) U6.7(PS) U6.11(VDDIO) U6.14(CSB1) U7.3(WP(D2)) U7.7(HOLD(IO3)) U7.8(VCC)
GND: C8.1 C9.1 C10.1 J2.2 J3.1 J4.2 J5.2 U5.3(GND) U6.2(NC) U6.4(GND) U6.6(GNDIO) U6.10(SDO2) U6.15(SDO1) U7.4(GND)
MCU-MISO: J3.3 U7.2(SO(D1)) ; port MISO
MCU-MOSI: J3.4 U7.5(SI(D0)) ; port MOSI
MCU-RX-GPS: J5.3 ; port RX-GPS
MCU-RX-RF: J4.3 ; port RX-RF
MCU-SCK: J3.2 U7.6(SCK) ; port SCK
MCU-SCL: J2.1 U5.8(SCLK) U6.8(SCL) ; port SCL
MCU-SDA: J2.3 U5.7(SDI/SDA) U6.9(SDA) ; port SDA
MCU-SS: J3.5 R13.1 U7.1(CS) ; port SS
MCU-TX-GPS: J5.1 ; port TX-GPS
MCU-TX-RF: J4.1 ; port TX-RF

Not connected (* = marked no-connect by the designer): U5 6(SDO)*; U6 1(INT2)* 5(CSB2)* 12(INT3)* 13(INT4)* 16(INT1)*

### Notes on the sheet
- I2C Adress : 0x76
- I2C Adress
- A: 0x18
- G : 0x68

### Library data of the parts
C8-C10 = CAP 0603 50V: Capacitor SMD 0603 50V
J4 J5 = JST B3B-XH-A: Connector Header, XH Series, 3 Position, 2.50mm, Through Hole, Press-Fit, Solder, Natural; Manufacturer Part Number: B3B-XH-A(LF)(SN); Supplier 1: CoreStaff; Manufacturer: JST; RoHS: Yes; Category: Headers and Wire Housings; Stock 1: 2101; Pricing 1: 1=39,94, 10=25,1, 50=21,68, 100=18,25, 500=17,57, 1000=17,12, 2000=16,44, 4000=15,79 (JPY); ComponentLink1URL: https://datasheet.ciiva.com/26894/getdatasheetpartid-640434-26894454.pdf?src-supplier=Verical; ComponentLink1Description: https://datasheet.ciiva.com/26894/getdatasheetpartid-640434-26894454.pdf?src-supplier=Verical; ComponentLink2URL: https://datasheet.ciiva.com/26894/getdatasheetpartid-440399-26894778.pdf?src-supplier=Verical; ComponentLink2Description: https://datasheet.ciiva.com/26894/getdatasheetpartid-440399-26894778.pdf?src-supplier=Verical; ComponentLink3URL: https://datasheet.ciiva.com/11746/0900766b8082653f-11746520.pdf?src-supplier=Rs; ComponentLink3Description: https://datasheet.ciiva.com/11746/0900766b8082653f-11746520.pdf?src-supplier=Rs
R13 = RES 0603: Resistor SMD 0603
U5 = MS561101BA03-50: Pressure Sensor 1.44V to 3.6V 0.01bar to 1.2bar Absolute 8-Pin QFN T/R; Manufacturer: TE Connectivity; Supplier 1: Arrow Electronics; Manufacturer Part Number: MS561101BA03-50; RoHS: Yes; Category: Pressure Sensors; Stock 1: 1119; Pricing 1: 1=6,627, 10=6,524, 25=6,422, 100=6,32, 250=6,218, 500=6,115, 1000=6,013 (USD); ComponentLink1URL: http://www.farnell.com/datasheets/2917208.pdf?src-supplier=Farnell; ComponentLink1Description: http://www.farnell.com/datasheets/2917208.pdf?src-supplier=Farnell; ComponentLink2URL: https://www.te.com/commerce/DocumentDelivery/DDEController?Action=srchrtrv&DocNm=MS5611-01BA03&DocType=Data+Sheet&DocLang=English&src-supplier=Digi-Key; ComponentLink2Description: https://www.te.com/commerce/DocumentDelivery/DDEController?Action=srchrtrv&DocNm=MS5611-01BA03&DocType=Data+Sheet&DocLang=English&src-supplier=Digi-Key; ComponentLink3URL: https://datasheet.octopart.com/MS561101BA03-50-TE-Connectivity-datasheet-21074432.pdf?src-supplier=Element14; ComponentLink3Description: https://datasheet.octopart.com/MS561101BA03-50-TE-Connectivity-datasheet-21074432.pdf?src-supplier=Element14; ComponentLink4URL: http://www.farnell.com/datasheets/1756128.pdf?src-supplier=Newark; ComponentLink4Description: http://www.farnell.com/datasheets/1756128.pdf?src-supplier=Newark; ComponentLink5URL: https://datasheet.octopart.com/MS561101BA03-50-TE-Connectivity-datasheet-65793092.pdf?src-supplier=Future+Electronics; ComponentLink5Description: https://datasheet.octopart.com/MS561101BA03-50-TE-Connectivity-datasheet-65793092.pdf?src-supplier=Future+Electronics; ComponentLink6URL: https://datasheet.octopart.com/MS561101BA03-50-TE-Connectivity-datasheet-134530980.pdf?src-supplier=Master+Electronics; ComponentLink6Description: https://datasheet.octopart.com/MS561101BA03-50-TE-Connectivity-datasheet-134530980.pdf?src-supplier=Master+Electronics
U6 = BMI088: BMI088 Series 3.6 V 6 Axis Digital Output Accelerometer Motion Sensor - LGA-16; Manufacturer: Bosch Tools; Supplier 1: Arrow Electronics; Manufacturer Part Number: BMI088; RoHS: No; Category: Inertial Measurement Units (IMUs); Stock 1: 2228; Pricing 1: 1=3,4884, 10=3,3155, 25=3,2816, 50=3,2477, 100=3,2147, 500=3,1828 (USD); ComponentLink1URL: https://ae-bst.resource.bosch.com/media/_tech/media/product_flyer/Bosch_Sensortec_Product_flyer_BMI088.pdf?src-supplier=Digi-Key; ComponentLink1Description: https://ae-bst.resource.bosch.com/media/_tech/media/product_flyer/Bosch_Sensortec_Product_flyer_BMI088.pdf?src-supplier=Digi-Key; ComponentLink2URL: https://ae-bst.resource.bosch.com/media/_tech/media/application_notes/BST-MIS-HS001.pdf?src-supplier=Digi-Key; ComponentLink2Description: https://ae-bst.resource.bosch.com/media/_tech/media/application_notes/BST-MIS-HS001.pdf?src-supplier=Digi-Key
U7 = W25Q64JVSSIQ: IC FLASH 64MBIT 104MHZ 8SOIC; Manufacturer: Winbond; Memory Type: Non-Volatile,FLASH; Frequency: 133MHz; Memory Size: 64Mb; Supplier 1: Digi-Key; Manufacturer Part Number: W25Q64JVSSIQ; RoHS: Yes; Category: Flash; Stock 1: 138661; Pricing 1: 1=1,03, 25=0,9212, 100=0,8173, 500=0,7987, 5000=0,72112 (USD); Mount: Surface Mount; Case/Package: SOIC; Number of Pins: 8; Min Operating Temperature: -40°C; Max Operating Temperature: 85°C; Packaging: Rail/Tube; Series: SpiFlash®; RoHS Compliant: Yes; ComponentLink1URL: http://www.winbond.com/resource-files/w25q64jv%20revj%2003272018%20plus.pdf?src-supplier=Digi-Key; ComponentLink1Description: http://www.winbond.com/resource-files/w25q64jv%20revj%2003272018%20plus.pdf?src-supplier=Digi-Key

## Nets that join several sheets
3V3: MCU (11 pins), Power (C14.2 C15.2 R14.1 U9.5), Peripheral (17 pins)
5V: MCU (C2.1 FB1.1), Power (5 pins)
GND: MCU (16 pins), Power (16 pins), Peripheral (14 pins)
DP1: MCU (R11.2), Power (R15.1)
DP2: MCU (R12.2), Power (R17.1)
MCU-MISO: MCU (U3.16), Peripheral (J3.3 U7.2)
MCU-MOSI: MCU (U3.15), Peripheral (J3.4 U7.5)
MCU-RX-GPS: MCU (U3.11), Peripheral (J5.3)
MCU-RX-RF: MCU (U3.9), Peripheral (J4.3)
MCU-SCK: MCU (U3.17), Peripheral (J3.2 U7.6)
MCU-SCL: MCU (R10.1 U3.28), Peripheral (J2.1 U5.8 U6.8)
MCU-SDA: MCU (R9.1 U3.27), Peripheral (J2.3 U5.7 U6.9)
MCU-SS: MCU (U3.14), Peripheral (J3.5 R13.1 U7.1)
MCU-TX-GPS: MCU (U3.12), Peripheral (J5.1)
MCU-TX-RF: MCU (U3.10), Peripheral (J4.1)